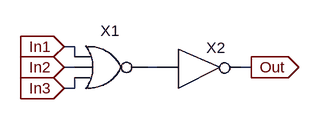
[diagram p0: schematic OR3.asc]
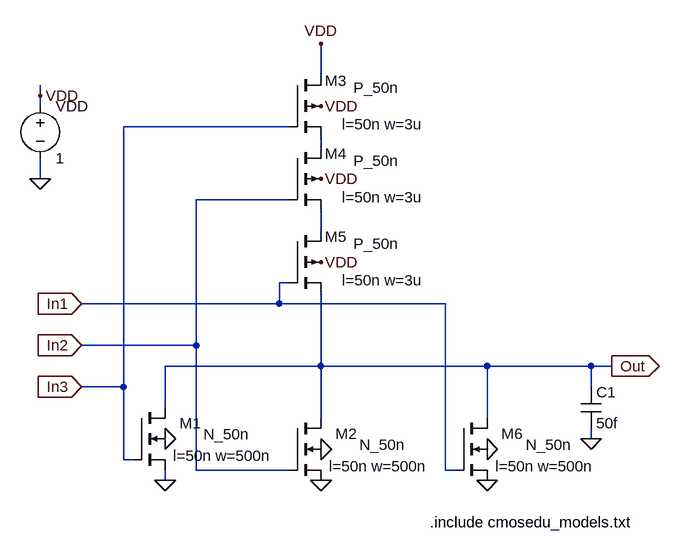
[diagram p1: sub-circuit nor3.asc]
OR3.asc, the LTspice schematic file:
Version 4
SHEET 1 1136 680
WIRE 384 240 368 240
WIRE 384 256 384 240
WIRE 384 272 368 272
WIRE 512 272 496 272
WIRE 656 272 640 272
WIRE 384 304 384 288
WIRE 384 304 368 304
FLAG 656 272 Out
IOPIN 656 272 Out
FLAG 368 240 In1
IOPIN 368 240 In
FLAG 368 272 In2
IOPIN 368 272 In
FLAG 368 304 In3
IOPIN 368 304 In
SYMBOL NOT 544 240 R0
SYMATTR InstName X2
SYMBOL NOR3 432 208 R0
SYMATTR InstName X1

nor3.asc, the sub-circuit schematic file:
Version 4
SHEET 1 1272 680
WIRE 736 -640 736 -688
WIRE 304 -608 304 -624
WIRE 304 -592 304 -608
WIRE 688 -560 432 -560
WIRE 736 -528 736 -544
WIRE 304 -480 304 -512
WIRE 688 -448 544 -448
WIRE 736 -400 736 -432
WIRE 688 -320 672 -320
WIRE 672 -288 672 -320
WIRE 672 -288 368 -288
WIRE 928 -288 672 -288
WIRE 544 -224 544 -448
WIRE 544 -224 368 -224
WIRE 736 -192 736 -304
WIRE 736 -192 496 -192
WIRE 992 -192 736 -192
WIRE 1152 -192 992 -192
WIRE 1184 -192 1152 -192
WIRE 432 -160 432 -560
WIRE 432 -160 368 -160
WIRE 1152 -160 1152 -192
WIRE 496 -128 496 -192
WIRE 736 -112 736 -192
WIRE 992 -112 992 -192
WIRE 1152 -80 1152 -96
WIRE 432 -48 432 -160
WIRE 448 -48 432 -48
WIRE 544 -32 544 -224
WIRE 688 -32 544 -32
WIRE 928 -32 928 -288
WIRE 944 -32 928 -32
WIRE 496 -16 496 -32
FLAG 736 -64 0
FLAG 304 -480 0
FLAG 304 -608 VDD
FLAG 736 -592 VDD
FLAG 496 -16 0
FLAG 736 -688 VDD
FLAG 736 -480 VDD
FLAG 496 -80 0
FLAG 1152 -80 0
FLAG 736 -16 0
FLAG 736 -352 VDD
FLAG 992 -64 0
FLAG 992 -16 0
FLAG 1184 -192 Out
IOPIN 1184 -192 Out
FLAG 368 -288 In1
IOPIN 368 -288 In
FLAG 368 -224 In2
IOPIN 368 -224 In
FLAG 368 -160 In3
IOPIN 368 -160 In
SYMBOL voltage 304 -608 R0
WINDOW 123 0 0 Left 2
WINDOW 39 0 0 Left 2
SYMATTR InstName VDD
SYMATTR Value 1
SYMBOL pmos4 688 -640 R0
WINDOW 0 88 9 Right 2
WINDOW 3 168 20 Right 2
WINDOW 123 206 76 Right 2
SYMATTR InstName M3
SYMATTR Value P_50n
SYMATTR Value2 l=50n w=3u
SYMBOL nmos4 448 -128 R0
WINDOW 0 104 24 Right 2
WINDOW 3 179 41 Right 2
WINDOW 123 213 74 Right 2
SYMATTR InstName M1
SYMATTR Value N_50n
SYMATTR Value2 l=50n w=500n
SYMBOL nmos4 688 -112 R0
WINDOW 0 104 24 Right 2
WINDOW 3 179 41 Right 2
WINDOW 123 213 74 Right 2
SYMATTR InstName M2
SYMATTR Value N_50n
SYMATTR Value2 l=50n w=500n
SYMBOL pmos4 688 -528 R0
WINDOW 0 88 9 Right 2
WINDOW 3 168 20 Right 2
WINDOW 123 206 76 Right 2
SYMATTR InstName M4
SYMATTR Value P_50n
SYMATTR Value2 l=50n w=3u
SYMBOL cap 1136 -160 R0
SYMATTR InstName C1
SYMATTR Value 50f
SYMBOL pmos4 688 -400 R0
WINDOW 0 88 9 Right 2
WINDOW 3 168 20 Right 2
WINDOW 123 206 76 Right 2
SYMATTR InstName M5
SYMATTR Value P_50n
SYMATTR Value2 l=50n w=3u
SYMBOL nmos4 944 -112 R0
WINDOW 0 104 24 Right 2
WINDOW 3 179 41 Right 2
WINDOW 123 213 74 Right 2
SYMATTR InstName M6
SYMATTR Value N_50n
SYMATTR Value2 l=50n w=500n
TEXT 904 48 Left 2 !.include cmosedu_models.txt

The netlist it stands for:
* OR3.asc
XX2 N001 Out NOT  ; pins In Out
XX1 In1 In2 In3 N001 nor3

* block symbol definitions
.subckt nor3 In1 In2 In3 Out
VDD VDD 0 1
M3 VDD In3 N001 VDD P_50n l=50n w=3u
M1 Out In3 0 0 N_50n l=50n w=500n
M2 Out In2 0 0 N_50n l=50n w=500n
M4 N001 In2 N002 VDD P_50n l=50n w=3u
C1 Out 0 50f
M5 N002 In1 Out VDD P_50n l=50n w=3u
M6 Out In1 0 0 N_50n l=50n w=500n
.include cmosedu_models.txt
.ends nor3

.model NMOS NMOS
.model PMOS PMOS
.lib standard.mos
.backanno
.end